# EasyEDA schematic nixie clock.json
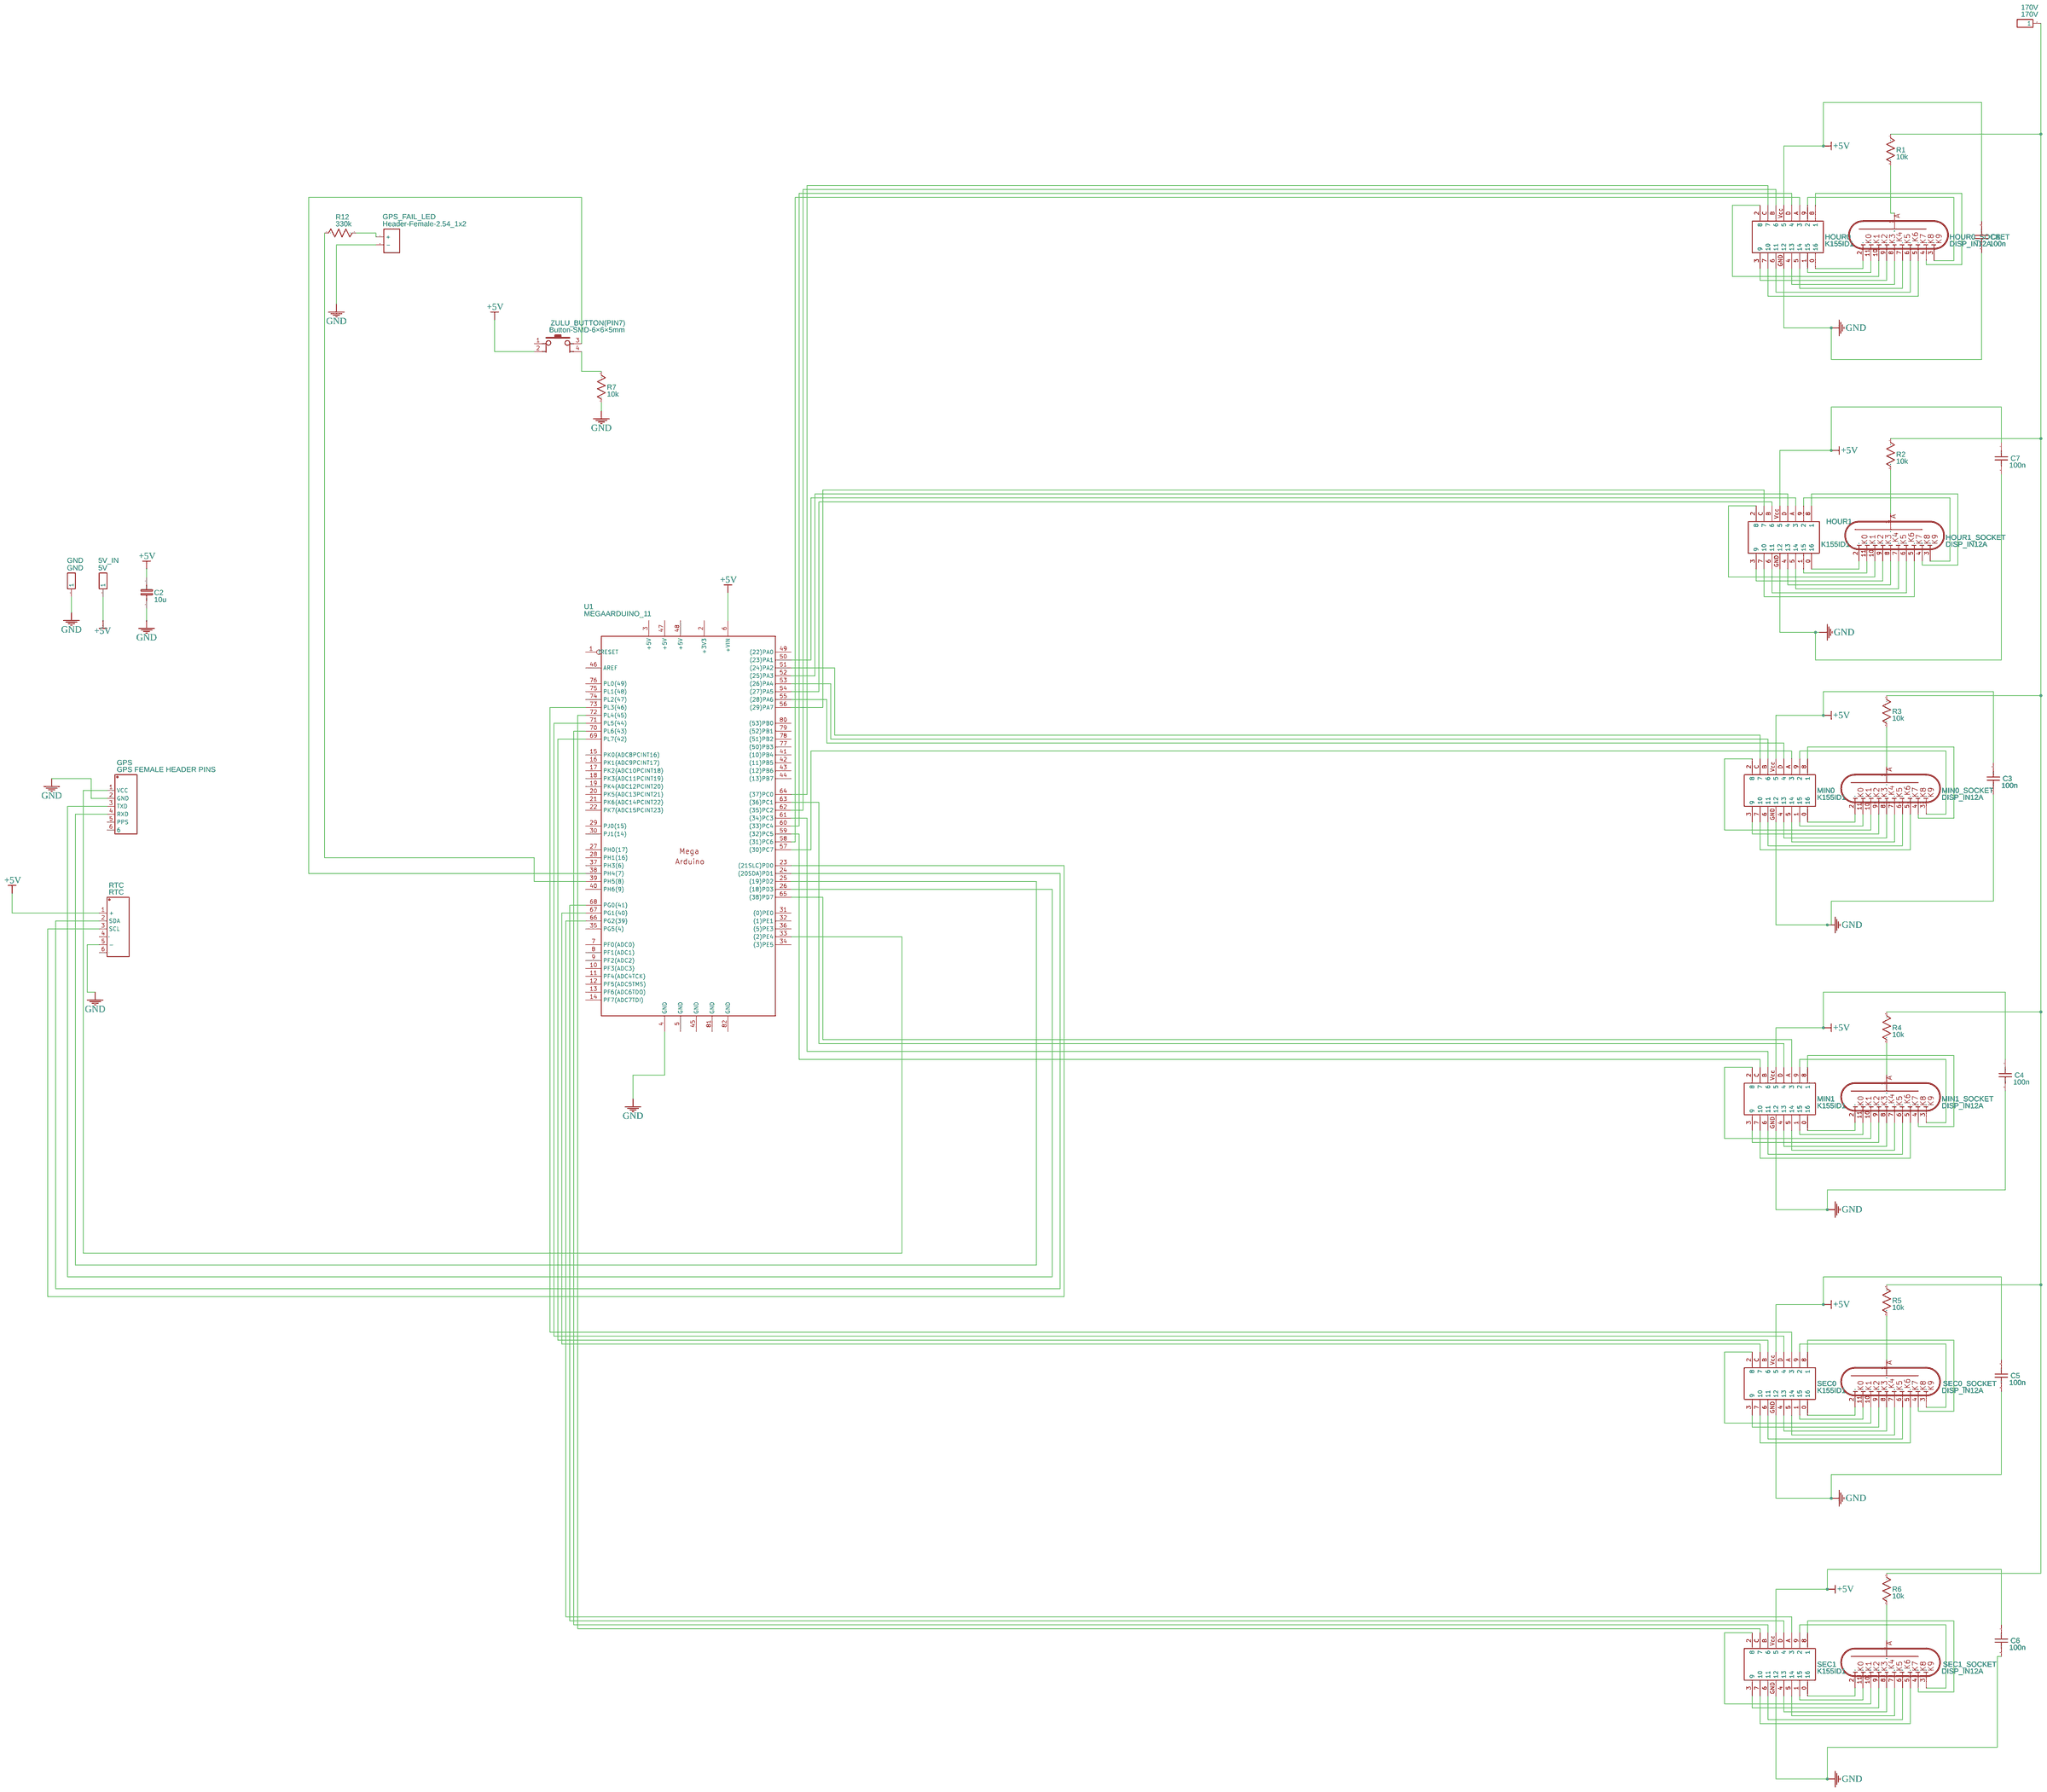
[diagram p0: schematic sheet]

## Parts
5V_IN  5V  [HDR-1X1/2.54]
170V  170V  [HDR-1X1/2.54]
C2  10u  [RAD-0.1]
C3  100n  [RAD-0.1]
C4  100n  [RAD-0.1]
C5  100n  [RAD-0.1]
C6  100n  [RAD-0.1]
C7  100n  [RAD-0.1]
C8  100n  [RAD-0.1]
GND  GND  [HDR-1X1/2.54]
GPS  GPS FEMALE HEADER PINS  [HDR-2.54-1X13P]
GPS_FAIL_LED  Header-Female-2.54_1x2  [HDR-TH_2P-P2.54-V-M]
HOUR0  K155ID1  [K155NA1 MAP2]
HOUR0_SOCKET  DISP_IN12A  [DISP_IN-12_SOCKET]
HOUR1  K155ID1  [K155NA1 MAP2]
HOUR1_SOCKET  DISP_IN12A  [DISP_IN-12_SOCKET]
MIN0  K155ID1  [K155NA1 MAP2]
MIN0_SOCKET  DISP_IN12A  [DISP_IN-12_SOCKET]
MIN1  K155ID1  [K155NA1 MAP2]
MIN1_SOCKET  DISP_IN12A  [DISP_IN-12_SOCKET]
R1  10k  [AXIAL-0.3]
R2  10k  [AXIAL-0.3]
R3  10k  [AXIAL-0.3]
R4  10k  [AXIAL-0.3]
R5  10k  [AXIAL-0.3]
R6  10k  [AXIAL-0.3]
R7  10k  [AXIAL-0.3]
R12  330k  [AXIAL-0.3]
RTC  RTC  [HDR-2.54-1X13P]
SEC0  K155ID1  [K155NA1 MAP2]
SEC0_SOCKET  DISP_IN12A  [DISP_IN-12_SOCKET]
SEC1  K155ID1  [K155NA1 MAP2]
SEC1_SOCKET  DISP_IN12A  [DISP_IN-12_SOCKET]
U1  MEGAARDUINO_11  [MEGA_ARDUINO_1]
ZULU_BUTTON(PIN7)  Button-SMD-6×6×5mm  [SW-SMD_4PIN-L6.00-W6.00]

## Library data of the parts
5V_IN 170V GND = Header-Male-2.54_1x1: Supplier: LCSC; Manufacturer: ReliaPro; Supplier Part: C81276
C2 = Cap_RAD-0.1_EU
C3-C8 = Cap_RAD-0.1_US
GPS RTC = Headers_Pins2.54_1x6: Supplier Part: C53043; Supplier: LCSC; Manufacturer: ReliaPro; Manufacturer Part: Headers  Pins2.54; image: http://image.lceda.cn/szlcsc/C53043.jpg; Contributor: kazuhiro_h
GPS_FAIL_LED = Header-Female-2.54_1x2: Supplier: LCSC; Manufacturer: BOOMELE; Manufacturer Part: 2.54-1*2PFemale; image: //image.lceda.cn/szlcsc/C49661.jpg; Supplier Part: C49661
HOUR0 HOUR1 MIN0 MIN1 SEC0 SEC1 = K155ID1: Contributor: ned50
HOUR0_SOCKET HOUR1_SOCKET MIN0_SOCKET MIN1_SOCKET SEC0_SOCKET SEC1_SOCKET = DISP_IN12A: IN-12A Nixie Display; Contributor: Guest
R1-R7 R12 = Res_AXIAL-0.3(1/8W)_US
U1 = MEGAARDUINO_11
ZULU_BUTTON(PIN7) = Button-SMD-6×6×5mm: Supplier: LCSC; Manufacturer: ReliaPro; Manufacturer Part: 6×6×5mm RHOS; image: //image.lceda.cn/szlcsc/C21456.jpg; Supplier Part: C21456

## Nets
+5V: 5V_IN.1 C2.1 C3.1 C4.1 C5.1 C6.1 C7.1 C8.1 HOUR0.Vcc(5) HOUR1.Vcc(5) MIN0.Vcc(5) MIN1.Vcc(5) RTC.1(+) SEC0.Vcc(5) SEC1.Vcc(5) U1.6(+VIN) ZULU_BUTTON(PIN7).2
GND: C2.2 C3.2 C4.2 C5.2 C6.2 C7.2 C8.2 GND.1 GPS.2(GND) GPS_FAIL_LED.2(-) HOUR0.GND(12) HOUR1.GND(12) MIN0.GND(12) MIN1.GND(12) R7.1 RTC.5(-) SEC0.GND(12) SEC1.GND(12) U1.4(GND)
Net-(170V-1): 170V.1 R1.1 R2.1 R3.1 R4.1 R5.1 R6.1
Net-(GPS-1): GPS.1(VCC) U1.33((2)PE4)
Net-(GPS-3): GPS.3(TXD) U1.26((18)PD3)
Net-(GPS-4): GPS.4(RXD) U1.25((19)PD2)
Net-(GPS_FAIL_LED-1): GPS_FAIL_LED.1(+) R12.2
Net-(HOUR0-0): HOUR0.0(16) HOUR0_SOCKET.2(K0)
Net-(HOUR0-1): HOUR0.1(15) HOUR0_SOCKET.11(K1)
Net-(HOUR0-2): HOUR0.2(8) HOUR0_SOCKET.10(K2)
Net-(HOUR0-3): HOUR0.3(9) HOUR0_SOCKET.9(K3)
Net-(HOUR0-4): HOUR0.4(13) HOUR0_SOCKET.8(K4)
Net-(HOUR0-5): HOUR0.5(14) HOUR0_SOCKET.7(K5)
Net-(HOUR0-6): HOUR0.6(11) HOUR0_SOCKET.6(K6)
Net-(HOUR0-7): HOUR0.7(10) HOUR0_SOCKET.5(K7)
Net-(HOUR0-8): HOUR0.8(1) HOUR0_SOCKET.4(K8)
Net-(HOUR0-9): HOUR0.9(2) HOUR0_SOCKET.3(K9)
Net-(HOUR0-A): HOUR0.A(3) U1.58((31)PC6)
Net-(HOUR0-B): HOUR0.B(6) U1.62((35)PC2)
Net-(HOUR0-C): HOUR0.C(7) U1.64((37)PC0)
Net-(HOUR0-D): HOUR0.D(4) U1.60((33)PC4)
Net-(HOUR0_SOCKET-1): HOUR0_SOCKET.1(ANODE) R1.2
Net-(HOUR1-0): HOUR1.0(16) HOUR1_SOCKET.2(K0)
Net-(HOUR1-1): HOUR1.1(15) HOUR1_SOCKET.11(K1)
Net-(HOUR1-2): HOUR1.2(8) HOUR1_SOCKET.10(K2)
Net-(HOUR1-3): HOUR1.3(9) HOUR1_SOCKET.9(K3)
Net-(HOUR1-4): HOUR1.4(13) HOUR1_SOCKET.8(K4)
Net-(HOUR1-5): HOUR1.5(14) HOUR1_SOCKET.7(K5)
Net-(HOUR1-6): HOUR1.6(11) HOUR1_SOCKET.6(K6)
Net-(HOUR1-7): HOUR1.7(10) HOUR1_SOCKET.5(K7)
Net-(HOUR1-8): HOUR1.8(1) HOUR1_SOCKET.4(K8)
Net-(HOUR1-9): HOUR1.9(2) HOUR1_SOCKET.3(K9)
Net-(HOUR1-A): HOUR1.A(3) U1.50((23)PA1)
Net-(HOUR1-B): HOUR1.B(6) U1.54((27)PA5)
Net-(HOUR1-C): HOUR1.C(7) U1.56((29)PA7)
Net-(HOUR1-D): HOUR1.D(4) U1.52((25)PA3)
Net-(HOUR1_SOCKET-1): HOUR1_SOCKET.1(ANODE) R2.2
Net-(MIN0-0): MIN0.0(16) MIN0_SOCKET.2(K0)
Net-(MIN0-1): MIN0.1(15) MIN0_SOCKET.11(K1)
Net-(MIN0-2): MIN0.2(8) MIN0_SOCKET.10(K2)
Net-(MIN0-3): MIN0.3(9) MIN0_SOCKET.9(K3)
Net-(MIN0-4): MIN0.4(13) MIN0_SOCKET.8(K4)
Net-(MIN0-5): MIN0.5(14) MIN0_SOCKET.7(K5)
Net-(MIN0-6): MIN0.6(11) MIN0_SOCKET.6(K6)
Net-(MIN0-7): MIN0.7(10) MIN0_SOCKET.5(K7)
Net-(MIN0-8): MIN0.8(1) MIN0_SOCKET.4(K8)
Net-(MIN0-9): MIN0.9(2) MIN0_SOCKET.3(K9)
Net-(MIN0-A): MIN0.A(3) U1.57((30)PC7)
Net-(MIN0-B): MIN0.B(6) U1.53((26)PA4)
Net-(MIN0-C): MIN0.C(7) U1.51((24)PA2)
Net-(MIN0-D): MIN0.D(4) U1.55((28)PA6)
Net-(MIN0_SOCKET-1): MIN0_SOCKET.1(ANODE) R3.2
Net-(MIN1-0): MIN1.0(16) MIN1_SOCKET.2(K0)
Net-(MIN1-1): MIN1.1(15) MIN1_SOCKET.11(K1)
Net-(MIN1-2): MIN1.2(8) MIN1_SOCKET.10(K2)
Net-(MIN1-3): MIN1.3(9) MIN1_SOCKET.9(K3)
Net-(MIN1-4): MIN1.4(13) MIN1_SOCKET.8(K4)
Net-(MIN1-5): MIN1.5(14) MIN1_SOCKET.7(K5)
Net-(MIN1-6): MIN1.6(11) MIN1_SOCKET.6(K6)
Net-(MIN1-7): MIN1.7(10) MIN1_SOCKET.5(K7)
Net-(MIN1-8): MIN1.8(1) MIN1_SOCKET.4(K8)
Net-(MIN1-9): MIN1.9(2) MIN1_SOCKET.3(K9)
Net-(MIN1-A): MIN1.A(3) U1.65((38)PD7)
Net-(MIN1-B): MIN1.B(6) U1.61((34)PC3)
Net-(MIN1-C): MIN1.C(7) U1.59((32)PC5)
Net-(MIN1-D): MIN1.D(4) U1.63((36)PC1)
Net-(MIN1_SOCKET-1): MIN1_SOCKET.1(ANODE) R4.2
Net-(R5-2): R5.2 SEC0_SOCKET.1(ANODE)
Net-(R6-2): R6.2 SEC1_SOCKET.1(ANODE)
Net-(R7-2): R7.2 ZULU_BUTTON(PIN7).4
Net-(R12-1): R12.1 U1.39(PH5(8))
Net-(RTC-2): RTC.2(SDA) U1.24((20SDA)PD1)
Net-(RTC-3): RTC.3(SCL) U1.23((21SLC)PD0)
Net-(SEC0-0): SEC0.0(16) SEC0_SOCKET.2(K0)
Net-(SEC0-1): SEC0.1(15) SEC0_SOCKET.11(K1)
Net-(SEC0-2): SEC0.2(8) SEC0_SOCKET.10(K2)
Net-(SEC0-3): SEC0.3(9) SEC0_SOCKET.9(K3)
Net-(SEC0-4): SEC0.4(13) SEC0_SOCKET.8(K4)
Net-(SEC0-5): SEC0.5(14) SEC0_SOCKET.7(K5)
Net-(SEC0-6): SEC0.6(11) SEC0_SOCKET.6(K6)
Net-(SEC0-7): SEC0.7(10) SEC0_SOCKET.5(K7)
Net-(SEC0-8): SEC0.8(1) SEC0_SOCKET.4(K8)
Net-(SEC0-9): SEC0.9(2) SEC0_SOCKET.3(K9)
Net-(SEC0-A): SEC0.A(3) U1.73(PL3(46))
Net-(SEC0-B): SEC0.B(6) U1.69(PL7(42))
Net-(SEC0-C): SEC0.C(7) U1.67(PG1(40))
Net-(SEC0-D): SEC0.D(4) U1.71(PL5(44))
Net-(SEC1-0): SEC1.0(16) SEC1_SOCKET.2(K0)
Net-(SEC1-1): SEC1.1(15) SEC1_SOCKET.11(K1)
Net-(SEC1-2): SEC1.2(8) SEC1_SOCKET.10(K2)
Net-(SEC1-3): SEC1.3(9) SEC1_SOCKET.9(K3)
Net-(SEC1-4): SEC1.4(13) SEC1_SOCKET.8(K4)
Net-(SEC1-5): SEC1.5(14) SEC1_SOCKET.7(K5)
Net-(SEC1-6): SEC1.6(11) SEC1_SOCKET.6(K6)
Net-(SEC1-7): SEC1.7(10) SEC1_SOCKET.5(K7)
Net-(SEC1-8): SEC1.8(1) SEC1_SOCKET.4(K8)
Net-(SEC1-9): SEC1.9(2) SEC1_SOCKET.3(K9)
Net-(SEC1-A): SEC1.A(3) U1.66(PG2(39))
Net-(SEC1-B): SEC1.B(6) U1.70(PL6(43))
Net-(SEC1-C): SEC1.C(7) U1.72(PL4(45))
Net-(SEC1-D): SEC1.D(4) U1.68(PG0(41))
Net-(U1-38): U1.38(PH4(7)) ZULU_BUTTON(PIN7).3

Not connected (* = marked no-connect by the designer): GPS 5(PPS) 6; RTC 4(TXD) 6(-); U1 1(!RESET) 2(+3V3) 3(+5V) 5(GND) 7(PF0(ADC0)) 8(PF1(ADC1)) 9(PF2(ADC2)) 10(PF3(ADC3)) 11(PF4(ADC4TCK)) 12(PF5(ADC5TMS)) 13(PF6(ADC6TDO)) 14(PF7(ADC7TDI)) 15(PK0(ADC8PCINT16)) 16(PK1(ADC9PCINT17)) 17(PK2(ADC10PCINT18)) 18(PK3(ADC11PCINT19)) 19(PK4(ADC12PCINT20)) 20(PK5(ADC13PCINT21)) 21(PK6(ADC14PCINT22)) 22(PK7(ADC15PCINT23)) 27(PH0(17)) 28(PH1(16)) 29(PJ0(15)) 30(PJ1(14)) 31((0)PE0) 32((1)PE1) 34((3)PE5) 35(PG5(4)) 36((5)PE3) 37(PH3(6)) 40(PH6(9)) 41((10)PB4) 42((11)PB5) 43((12)PB6) 44((13)PB7) 45(GND) 46(AREF) 47(+5V) 48(+5V) 49((22)PA0) 74(PL2(47)) 75(PL1(48)) 76(PL0(49)) 77((50)PB3) 78((51)PB2) 79((52)PB1) 80((53)PB0) 81(GND) 82(GND); ZULU_BUTTON(PIN7) 1
